# Altium schematic sheet IO_Board.SchDoc
size A4; SheetNumber: 1; SheetTotal: 1
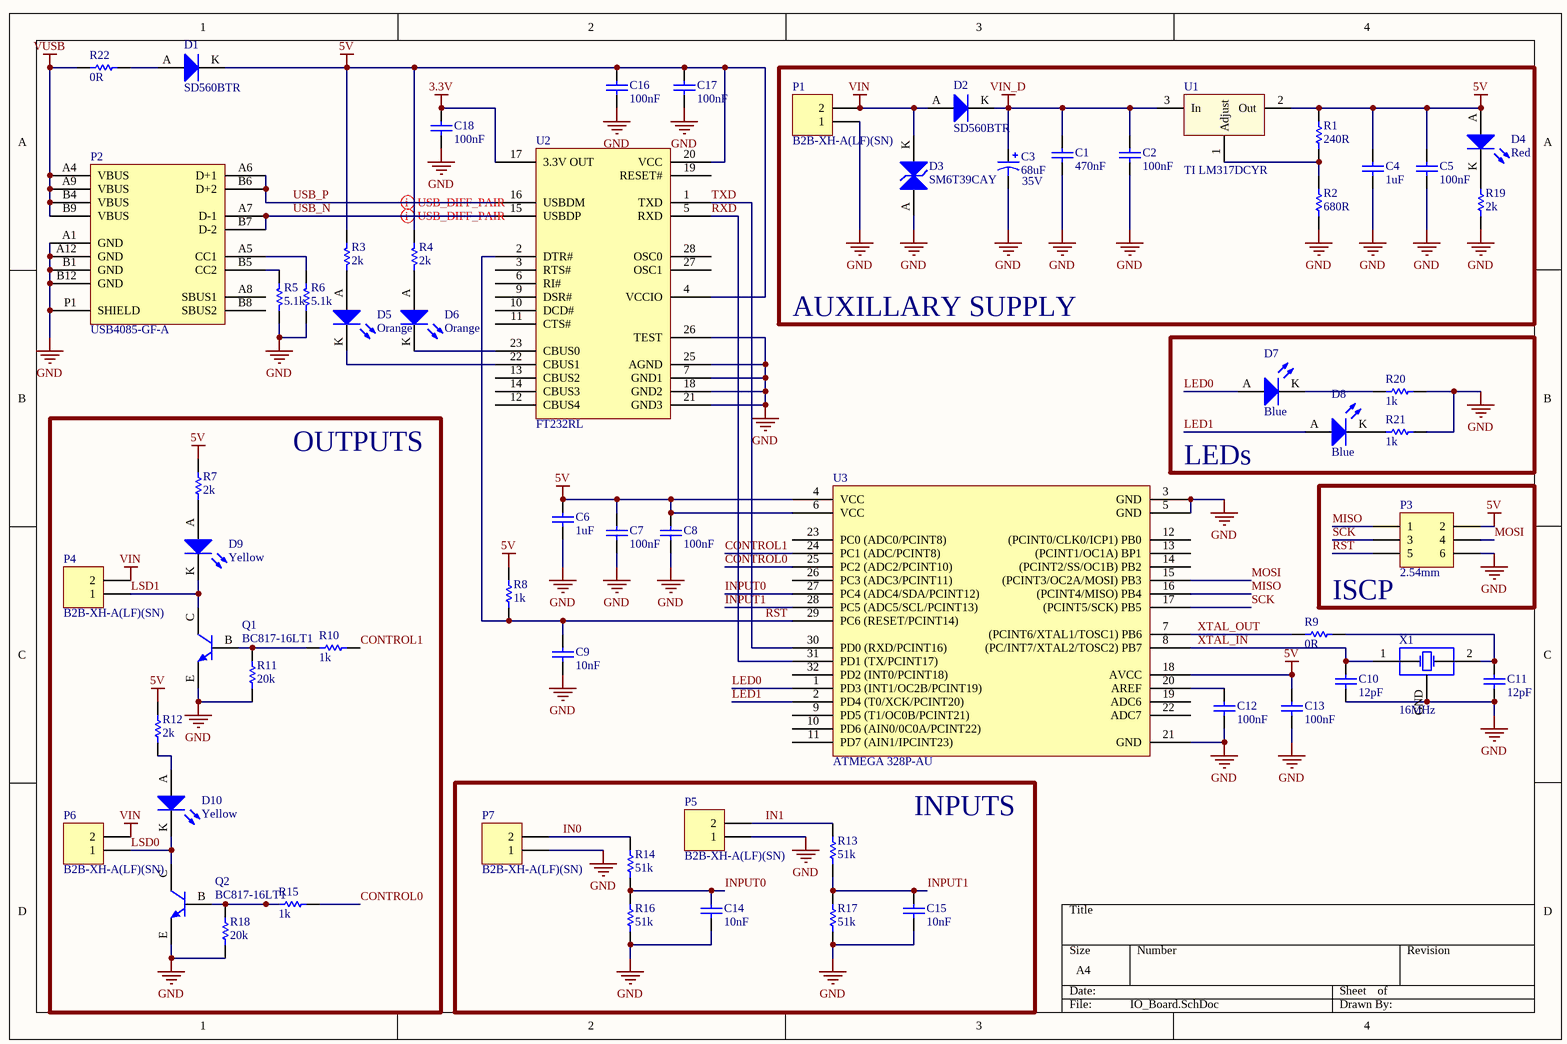
[diagram p0: IO_Board.SchDoc]

## Parts
C1  470nF  [0805]
C2  100nF  [0805]
C3  68uF  Rated Voltage: 35V  [2924]
C4  1uF  [0805]
C5  100nF  [0805]
C6  1uF  [0805]
C7  100nF  [0805]
C8  100nF  [0805]
C9  10nF  [0805]
C10  12pF  [0805]
C11  12pF  [0805]
C12  100nF  [0805]
C13  100nF  [0805]
C14  10nF  [0805]
C15  10nF  [0805]
C16  100nF  [0805]
C17  100nF  [0805]
C18  100nF  [0805]
D1  SD560BTR  [SMB Diode]
D2  SD560BTR  [SMB Diode]
D3  SM6T39CAY  [ST SMB Diode]
D4  Red  [0805 LED]
D5  Orange  [0805 LED]
D6  Orange  [0805 LED]
D7  Blue  [0805 LED]
D8  Blue  [0805 LED]
D9  Yellow  [0805 LED]
D10  Yellow  [0805 LED]
P1  B2B-XH-A(LF)(SN)  [XH 2 PIN VERT]
P2  USB4085-GF-A  [USB4085-GF-A]
P3  2.54mm  [TH 2.54mm Header 2x3]
P4  B2B-XH-A(LF)(SN)  [XH 2 PIN VERT]
P5  B2B-XH-A(LF)(SN)  [XH 2 PIN VERT]
P6  B2B-XH-A(LF)(SN)  [XH 2 PIN VERT]
P7  B2B-XH-A(LF)(SN)  [XH 2 PIN VERT]
Q1  BC817-16LT1  [ON SOT-23 BJT]
Q2  BC817-16LT1  [ON SOT-23 BJT]
R1  240R  [0805]
R2  680R  [0805]
R3  2k  [0805]
R4  2k  [0805]
R5  5.1k  [0805]
R6  5.1k  [0805]
R7  2k  [0805]
R8  1k  [0805]
R9  0R  [0805]
R10  1k  [0805]
R11  20k  [0805]
R12  2k  [0805]
R13  51k  [0805]
R14  51k  [0805]
R15  1k  [0805]
R16  51k  [0805]
R17  51k  [0805]
R18  20k  [0805]
R19  2k  [0805]
R20  1k  [0805]
R21  1k  [0805]
R22  0R  [0805]
U1  TI LM317DCYR  [TI SOT-223]
U2  FT232RL  [FTDI 28-SSOP]
U3  ATMEGA 328P-AU  [ATMEL TQFP-32]
X1  16MHz  [Abracon 4-SMD 3.2x2.5]

## Blocks framed on the sheet
AUXILLARY SUPPLY: C1-C5 D2-D4 P1 R1 R2 R19 U1
LEDs: D7 D8 R20 R21
OUTPUTS: D9 D10 P4 P6 Q1 Q2 R7 R10-R12 R15 R18
ISCP: P3
INPUTS: C14 C15 P5 P7 R13 R14 R16 R17

## Nets
3.3V: C18.2 U2.17(3.3V_OUT)
5V: C4.2 C5.2 C6.2 C7.2 C8.2 C13.2 C16.2 C17.2 D1.K D4.A P3.2 R1.2 R3.2 R4.2 R7.2 R8.2 R12.2 U1.2(Out) U2.4(VCCIO) U2.20(VCC) U3.4(VCC) U3.6(VCC) U3.18(AVCC)
GND: C1.1 C2.1 C3.1 C4.1 C5.1 C6.1 C7.1 C8.1 C9.1 C10.1 C11.1 C12.1 C13.1 C14.1 C15.1 C16.1 C17.1 C18.1 D3.A P1.1 P2.A1(GND) P2.A12(GND) P2.B1(GND) P2.B12(GND) P2.P1(SHIELD) P3.6 P5.1 P7.1 Q1.E Q2.E R2.1 R5.1 R6.1 R11.1 R16.2 R17.2 R18.1 R19.1 R20.1 R21.1 U2.7(GND1) U2.18(GND2) U2.21(GND3) U2.25(AGND) U2.26(TEST) U3.3(GND) U3.5(GND) U3.21(GND) X1.GND
VIN: D2.A D3.K P1.2 P4.2 P6.2
VIN_D: C1.2 C2.2 C3.2 D2.K U1.3(In)
VUSB: P2.A4(VBUS) P2.A9(VBUS) P2.B4(VBUS) P2.B9(VBUS) R22.1
CONTROL0: R15.2 U3.25(PC2_(ADC2/PCINT10))
CONTROL1: R10.2 U3.24(PC1_(ADC/PCINT8))
IN0: P7.2 R14.1
IN1: P5.2 R13.1
INPUT0: C14.2 R14.2 R16.1 U3.27(PC4_(ADC4/SDA/PCINT12))
INPUT1: C15.2 R13.2 R17.1 U3.28(PC5_(ADC5/SCL/PCINT13))
LED0: D7.A U3.1(PD3_(INT1/OC2B/PCINT19))
LED1: D8.A U3.2(PD4_(T0/XCK/PCINT20))
LSD0: D10.K P6.1 Q2.C
LSD1: D9.K P4.1 Q1.C
MISO: P3.1 U3.16((PCINT4/MISO)_PB4)
MOSI: P3.4 U3.15((PCINT3/OC2A/MOSI)_PB3)
RST: C9.2 P3.5 R8.1 U2.2(DTR#) U3.29(PC6_(RESET/PCINT14))
RXD: U2.5(RXD) U3.31(PD1_(TX/PCINT17))
SCK: P3.3 U3.17((PCINT5/SCK)_PB5)
TXD: U2.1(TXD) U3.30(PD0_(RXD/PCINT16))
USB_N: P2.A7(D-1) P2.B7(D-2) U2.15(USBDP)
USB_P: P2.A6(D+1) P2.B6(D+2) U2.16(USBDM)
XTAL_IN: C10.2 U3.8((PC/INT7/XTAL2/TOSC2)_PB7) X1.1(OSC1)
XTAL_OUT: R9.1 U3.7((PCINT6/XTAL1/TOSC1)_PB6)
NetC11_2: C11.2 R9.2 X1.2(OSC2)
NetC12_2: C12.2 U3.20(AREF)
NetD1_A: D1.A R22.2
NetD4_K: D4.K R19.2
NetD5_A: D5.A R3.1
NetD5_K: D5.K U2.22(CBUS1)
NetD6_A: D6.A R4.1
NetD6_K: D6.K U2.23(CBUS0)
NetD7_K: D7.K R20.2
NetD8_K: D8.K R21.2
NetD9_A: D9.A R7.1
NetD10_A: D10.A R12.1
NetP2_A5: P2.A5(CC1) R6.2
NetP2_B5: P2.B5(CC2) R5.2
NetQ1_B: Q1.B R10.1 R11.2
NetQ2_B: Q2.B R15.1 R18.2
NetR1_1: R1.1 R2.2 U1.1(Adjust)

Not connected (* = marked no-connect by the designer): P2 A8(SBUS1) B8(SBUS2); U2 3(RTS#) 6(RI#) 9(DSR#) 10(DCD#) 11(CTS#) 12(CBUS4) 13(CBUS2) 14(CBUS3) 19(RESET#) 27(OSC1) 28(OSC0); U3 9(PD5_(T1/OC0B/PCINT21)) 10(PD6_(AIN0/0C0A/PCINT22)) 11(PD7_(AIN1/IPCINT23)) 12((PCINT0/CLK0/ICP1)_PB0) 13((PCINT1/OC1A)_BP1) 14((PCINT2/SS/OC1B)_PB2) 19(ADC6) 22(ADC7) 23(PC0_(ADC0/PCINT8)) 26(PC3_(ADC3/PCINT11)) 32(PD2_(INT0/PCINT18))

## Layout directives
differential pair; differential pair class USB_DIFF_CLASS: USB_N, USB_P

## Library data of the parts
C1 = GCM21BR71H474KA37L: Manufacturer: muRata; Tolerance: 10%; Material: X7R; Rated Voltage: 50V; Part Number: GCM21BR71H474KA37L; Value: 470nF; Digikey Part Number: DO NOT USE FOR NEW DESIGNS
C2 C5 C7 C8 C12 C13 C16-C18 = GCM21BR71E104KA37L: Manufacturer: muRata; Tolerance: 10%; Material: X7R; Rated Voltage: 25V; Part Number: GCM21BR71E104KA37L; Value: 100nF; Digikey Part Number: DO NOT USE FOR NEW DESIGNS
C3 = TAJV686K035RNJ: Manufacturer: AVX Corporation; Tolerance: 10%; Material: Tantalum; Part Number: TAJV686K035RNJ; Value: 68uF; Digikey Part Number: 478-13135-1-ND
C4 C6 = AC0805KKX7R8BB105: Manufacturer: YAGEO; Tolerance: 10%; Material: X7R; Rated Voltage: 25V; Part Number: AC0805KKX7R8BB105; Value: 1uF; Digikey Part Number: DO NOT USE FOR NEW DESIGNS
C9 = GCM2195C1H103JA16D: Manufacturer: muRata; Tolerance: ±5%; Material: C0G, NP0; Rated Voltage: 50V; Part Number: GCM2195C1H103JA16D; Value: 10nF; Digikey Part Number: 490-4783-1-ND
C10 C11 = GCM21B5c1H120JA37L: Manufacturer: muRata; Tolerance: 5%; Material: C0G; Rated Voltage: 50V; Part Number: GCM21B5c1H120JA37L; Value: 12pF; Digikey Part Number: DO NOT USE FOR NEW DESIGNS
C14 C15 = GCM21BR71H103KA37L: Manufacturer: muRata; Tolerance: 10%; Material: X7R; Rated Voltage: 50V; Part Number: GCM21BR71H103KA37L; Value: 10nF; Digikey Part Number: DO NOT USE FOR NEW DESIGNS
D1 D2 = SD560BTR: 1.2V_F 600V 5A SMB; Manufacturer: SMC Diode Solutions; Part Number: SD560BTR; Digikey Part Number: 1655-1530-2-ND; Digikey Link: https://www.digikey.com/product-detail/en/smc-diode-solutions/SD560BTR/1655-1530-2-ND/6022620
D3 = SM6T39CAY: 42.8V Clamp 93A (8/20µs) Ipp Tvs Diode Surface Mount SMB (DO-214AA); Manufacturer: ST; Vf: 42.8; Part Number: SM6T39CAY; Vbr: 42.8V; Digikey Part Number: SM6T39CAY; Digikey Link: https://www.digikey.com/en/products/detail/stmicroelectronics/SM6T39CAY/2442903; Alternative Parts: https://www.digikey.com/en/products/detail/stmicroelectronics/SM6T39AY/2442901
D4 = SML-210LTT86: Red LED Indication - Discrete 1.75V 0805 (2012 Metric); Manufacturer: ROHM Semiconductor; Part Number: SML-210LTT86; Colour: Red; Digikey Part Number: 511-1286-1-ND; Digikey Link: https://www.digikey.com/product-detail/en/rohm-semiconductor/SML-210LTT86/511-1286-1-ND/637099
D5 D6 = SML-211DTT86: Orange LED Indication - Discrete 1.75V 0805 (2012 Metric); Manufacturer: ROHM Semiconductor; Part Number: SML-211DTT86; Colour: Orange; Digikey Part Number: 511-1291-1-ND; Digikey Link: https://www.digikey.com/product-detail/en/rohm-semiconductor/SML-211DTT86/511-1291-1-ND/637104
D7 D8 = SML-MN2BCTT86C: LED BLUE CLEAR 2012 SMD; Manufacturer: ROHM Semiconductor; Part Number: SML-MN2BCTT86C; Colour: Blue; Digikey Part Number: 846-1207-1-ND; Digikey Link: https://www.digikey.com/product-detail/en/rohm-semiconductor/SMLMN2BCTT86C/846-1207-1-ND/6057239
D9 D10 = SML-211YTT86: Yellow LED Indication - Discrete 1.75V 0805 (2012 Metric); Manufacturer: ROHM Semiconductor; Part Number: SML-211YTT86; Colour: Yellow; Digikey Part Number: 511-1293-1-ND; Digikey Link: https://www.digikey.com/product-detail/en/rohm-semiconductor/SML-211YTT86/511-1293-1-ND/637106
P1 P4-P7 = B2B-XH-A(LF)(SN): Positions: 2; Pitch: 2.54mm; Angle: 0; Flange: No; Contact: Tin; Part Number: B2B-XH-A(LF)(SN); Row Spacing: 2.54mm; Digikey Part Number: 455-2247-ND; Digikey Link: https://www.digikey.com.au/en/products/detail/jst-sales-america-inc/B2B-XH-A-LF-SN/1651045
P2 = USB4085-GF-A: USB - C (Type - C) USB 2.0 Receptacle Connector 16 Position Through Hole, Right Angle; Angle: 90; Part Number: USB4085-GF-A; Digikey Part Number: 2073-USB4085-GF-ACT-ND; Digikey Link: https://www.digikey.ee/product-detail/en/gct/USB4085-GF-A/2073-USB4085-GF-ACT-ND/9859733
P3 = TH 2.54mm Header 2x3: Positions: 6; Angle: 0; Flange: No; Contact: NA; Part Number: TH 2.54mm Header 2x3; Pitch: 2.54mm; Row Spacing: 2.54mm
Q1 Q2 = BC817-16LT1: 300mW  BJT NPN Transistor; Manufacturer: ON Semiconductor; Part Number: BC817-16LT1; Digikey Part Number: BC817-16LT1OSTR-ND; Digikey Link: https://www.digikey.com.au/product-detail/en/on-semiconductor/BC817-16LT1/BC817-16LT1OSTR-ND/606178
R1 = RC0805FR07240RL: Manufacturer: YAGEO; Tolerance: 0.01; Rated Voltage: 0.125W; Part Number: RC0805FR07240RL; Value: 240R; Material: FR-07; Digikey Part Number: 311-240CRCT-ND
R2 = RC0805FR07680RL: Manufacturer: YAGEO; Tolerance: 0.01; Rated Voltage: 0.125W; Part Number: RC0805FR07680RL; Value: 680R; Material: FR-07; Digikey Part Number: 311-680CRCT-ND
R3 R4 R7 R12 R19 = RC0805FR072KL: Manufacturer: YAGEO; Tolerance: 0.01; Rated Voltage: 0.125W; Part Number: RC0805FR072KL; Value: 2k; Material: FR-07; Digikey Part Number: 311-2.00KCRCT-ND
R5 R6 = RC0805FR075K1L: Manufacturer: YAGEO; Tolerance: 0.01; Rated Voltage: 0.125W; Part Number: RC0805FR075K1L; Value: 5.1k; Material: FR-07; Digikey Part Number: 311-5.10KCRCT-ND
R8 R10 R15 R20 R21 = RC0805FR071KL: Manufacturer: YAGEO; Tolerance: 0.01; Rated Voltage: 0.125W; Part Number: RC0805FR071KL; Value: 1k; Material: FR-07; Digikey Part Number: 311-1.00KCRCT-ND
R9 R22 = RC0805FR070RL: Manufacturer: YAGEO; Tolerance: 0.01; Rated Voltage: 0.125W; Part Number: RC0805FR070RL; Value: 0R; Material: FR-07; Digikey Part Number: 311-0.0CRCT-ND
R11 R18 = RC0805FR0720KL: Manufacturer: YAGEO; Tolerance: 0.01; Rated Voltage: 0.125W; Part Number: RC0805FR0720KL; Value: 20k; Material: FR-07; Digikey Part Number: 311-20.0KCRCT-ND
R13 R14 R16 R17 = RC0805FR0751KL: Manufacturer: YAGEO; Tolerance: 0.01; Rated Voltage: 0.125W; Part Number: RC0805FR0751KL; Value: 51k; Material: FR-07; Digikey Part Number: 311-51.0KCRCT-ND
U1 = TI LM317DCYR: Linear Voltage Regulator IC 1 Output 1.5A SOT-223-4; Manufacturer: Texas Instruments; Input Voltage: 3V-40V; Output Voltage: 1.25V-37V; Isolation: Non-Isolated; Part Number: TI LM317DCYR; Output Power: 1.5A; Digikey Part Number: 296-12602-1-ND; Digikey Link: https://www.digikey.com/product-detail/en/texas-instruments/LM317DCYR/296-12602-1-ND/443738
U2 = FT232RL: USB Bridge, USB to UART USB 2.0 UART Interface 28-SSOP; Manufacturer: FTDI; Part Number: FT232RL; Digikey Part Number: 768-1007-1-ND; Digikey Link: https://www.digikey.com/product-detail/en/ftdi-future-technology-devices-international-ltd/FT232RL-REEL/768-1007-1-ND/1836402
U3 = ATMEGA 328P-AU: AVR AVR® ATmega Microcontroller IC 8-Bit 20MHz 32KB (16K x 16) FLASH 32-TQFP (7x7); Manufacturer: ATMEL; Part Number: ATMEGA 328P-AU; Digikey Part Number: ATMEGA328P-AU-ND; Digikey Link: https://www.digikey.com/product-detail/en/microchip-technology/ATMEGA328P-AU/ATMEGA328P-AU-ND/1832260
X1 = ABM8AIG-16.000MHZ-12-2Z-T3: Manufacturer: Abracon LLC; Load Capacitance: 12pF; ESR: 70R; Part Number: ABM8AIG-16.000MHZ-12-2Z-T3; Value: 16MHz; Digikey Part Number: 535-13386-1-ND; Digikey Link: https://www.digikey.com/en/products/detail/abracon-llc/ABM8AIG-16-000MHZ-12-2Z-T3/5817586